# Altium project BUF802_Project.PrjPcb
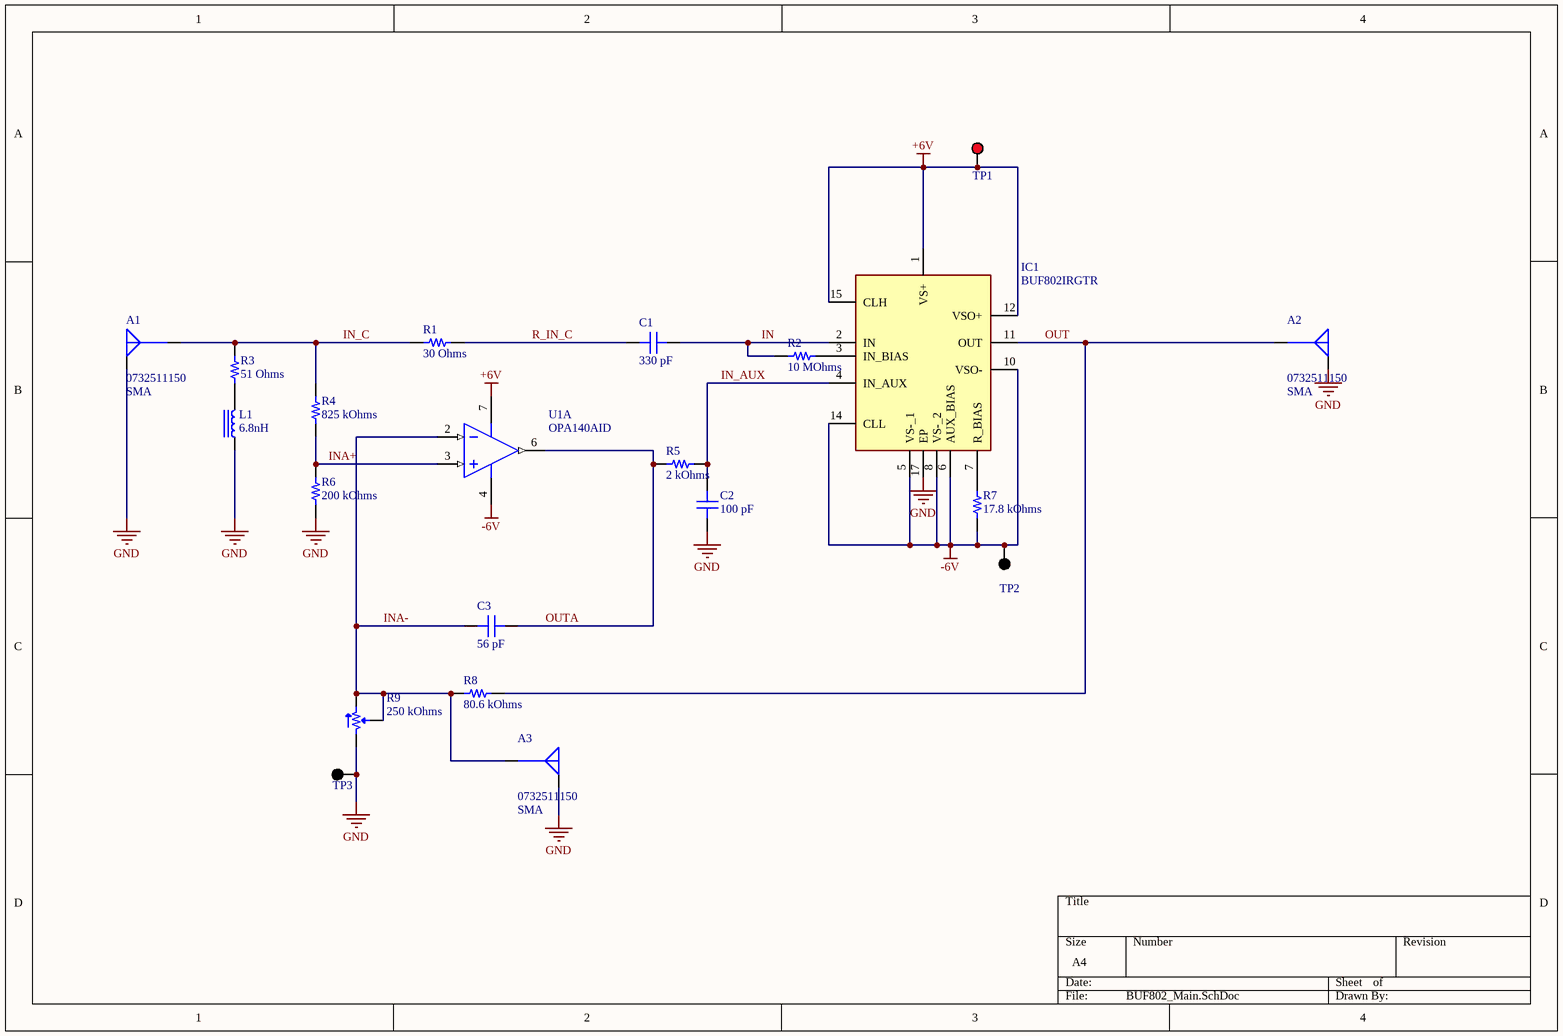
[diagram p0: BUF802_Main.SchDoc]
1 sheet, 21 parts. Net scope: global (net labels, ports and power ports of the same name join across sheets).
Board file: PCB.PcbDoc

## Sheet BUF802_Main.SchDoc
size A4; SheetNumber: 1; SheetTotal: 1

### Parts
A1  0732511150  Connector Style: SMA  [MOLEX SD-73251-115]
A2  0732511150  Connector Style: SMA  [MOLEX SD-73251-115]
A3  0732511150  Connector Style: SMA  [MOLEX SD-73251-115]
C1  330 pF  [CAP 0805_2012]
C2  100 pF  [CAP 0805_2012]
C3  56 pF  [CAP 0805_2012]
IC1  BUF802IRGTR  [QFN50P300X300X100-17N-D]
L1  6.8nH  [IND 0603_1608 RF WW]
R1  30 Ohms  [RES 0805_2012]
R2  10 MOhms  [RES 0805_2012]
R3  51 Ohms  [RES 0805_2012]
R4  825 kOhms  [RES 0805_2012]
R5  2 kOhms  [RES 0805_2012]
R6  200 kOhms  [RES 0805_2012]
R7  17.8 kOhms  [RES 0805_2012]
R8  80.6 kOhms  [RES 0805_2012]
R9  250 kOhms  [BOURNS TRIMPOT 3296W]
TP1  5000  [Keystone5000]  (value not drawn)
TP2  5001  [Keystone5001]  (value not drawn)
TP3  5001  [Keystone5001]  (value not drawn)
U1  OPA140AID  [D0008A_M]  (part A of 2)

### Nets
+6V: IC1.1(VS+) IC1.12(VSO+) IC1.15(CLH) TP1.1 U1.7(V+)
-6V: IC1.5(VS-_1) IC1.6(AUX_BIAS) IC1.8(VS-_2) IC1.10(VSO-) IC1.14(CLL) R7.1 TP2.1 U1.4(V-)
GND: A1.G A2.G A3.G C2.1 IC1.17(EP) L1.1 R6.1 R9.1 TP3.1
IN: C1.2 IC1.2(IN) R2.1
IN_AUX: C2.2 IC1.4(IN_AUX) R5.2
IN_C: A1.S R1.1 R3.2 R4.2
INA+: R4.1 R6.2 U1.3(IN+)
INA-: A3.S C3.1 R8.1 R9.2 R9.3 U1.2(IN-)
OUT: A2.S IC1.11(OUT) R8.2
OUTA: C3.2 R5.1 U1.6(OUT)
R_IN_C: C1.1 R1.2
NetIC1_3: IC1.3(IN_BIAS) R2.2
NetIC1_7: IC1.7(R_BIAS) R7.2
NetL1_2: L1.2 R3.1

### Library data of the parts
A1-A3 = 0732511150: CONN SMA RCPT STR 50OHM EDGE MNT; Manufacturer: Molex; Connector Type: Receptacle, Female Socket; Contact Termination: Solder; Frequency - Max: 18 GHz; Number of Ports: 1; Part Number: 0732511150; ComponentLink1Description: Datasheet; ComponentLink1URL: https://www.molex.com/pdm_docs/ps/PS-89675-346.pdf; ComponentLink2Description: DigiKey Link; ComponentLink2URL: https://www.digikey.com/en/products/detail/molex/0732511150/1465156; Fastening Type: Threaded; Housing Color: Gold; Impedance: 50Ohm; LastUpdated: 29-6-2022 18:06:18; Lifecycle Status: Active; Minimum Order: 1; Mounting Type: Board Edge, End Launch; Packaging: Tray; Part Status: Active; Price: 2.16; Series: 73251; Shield Termination: Solder; Supplier 1: DigiKey; Supplier Part Number 1: WM5534-ND
C1 = 0805N331K501NT: CAP CER 330PF 500V C0G/NP0 0805; manufacturer: Knowles Novacap; Temperature Coefficient: C0G, NP0; Tolerance: ±10%; Part Number: 0805N331K501NT; Value: 330 pF; Applications: General Purpose; Capacitance: 330 pF; componentlink1description: Datasheet; componentlink1url: https://www.knowlescapacitors.com/getattachment/f044c413-e6db-482e-8245-bb630384b177/Hi-Rel-C0G.aspx; componentlink2description: DigiKey Link; componentlink2url: https://www.digikey.com/en/products/detail/knowles-novacap/0805N331K501NT/7246439; Device Package: 0805 (2012 Metric); lastupdated: 28-4-2023 19:11:32; Lifecycle Status: Active; Minimum Order: 1; Mounting Type: Surface Mount, MLCC; Operating Temperature: -55°C ~ 125°C; Package / Case: 0805 (2012 Metric); packaging: TapeAndReel; partid: 14472; Part Status: Active; price: 0.09; series: -; Size / Dimension: 0.080" L x 0.050" W (2.03mm x 1.27mm); Supplier 1: DigiKey; Supplier Part Number 1: 1763-1199-1-ND; Thickness (Max): 0.054" (1.37mm); Voltage - Rated: 500V
C2 = 501R15N101KV4T: CAP CER 100PF 500V C0G/NP0 0805; manufacturer: Johanson Dielectrics Inc.; Temperature Coefficient: C0G, NP0; Tolerance: ±10%; Part Number: 501R15N101KV4T; Value: 100 pF; Applications: General Purpose; Capacitance: 100 pF; componentlink1description: Datasheet; componentlink1url: //media.digikey.com/pdf/Data%20Sheets/Johanson%20Dielectrics/High_Voltage_MLCC.pdf; componentlink2description: DigiKey Link; componentlink2url: https://www.digikey.com/en/products/detail/johanson-dielectrics-inc/501R15N101KV4T/1556341; Device Package: 0805 (2012 Metric); Features: High Voltage; lastupdated: 28-4-2023 19:11:22; Lifecycle Status: Active; Minimum Order: 1; Mounting Type: Surface Mount, MLCC; Operating Temperature: -55°C ~ 125°C; Package / Case: 0805 (2012 Metric); packaging: TapeAndReel; partid: 17109; Part Status: Active; price: 0.03; series: -; Size / Dimension: 0.080" L x 0.050" W (2.03mm x 1.27mm); Supplier 1: DigiKey; Supplier Part Number 1: 709-1019-1-ND; Thickness (Max): 0.055" (1.40mm); Voltage - Rated: 500V
C3 = 251R15S560GV4E: CAP CER 56PF 250V NP0 0805; manufacturer: Johanson Technology Inc.; Temperature Coefficient: C0G, NP0; Tolerance: ±2%; Part Number: 251R15S560GV4E; Value: 56 pF; Applications: RF, Microwave, High Frequency; Capacitance: 56 pF; componentlink1description: Datasheet; componentlink1url: https://www.johansontechnology.com/downloads/catalog/johanson-technology-multi-layer-high-q-capacitors.pdf; componentlink2description: DigiKey Link; componentlink2url: https://www.digikey.com/en/products/detail/johanson-technology-inc/251R15S560GV4E/1919542; Device Package: 0805 (2012 Metric); Features: High Q, Low Loss, Ultra Low ESR; lastupdated: 28-4-2023 19:11:18; Lifecycle Status: Active; Minimum Order: 1; Mounting Type: Surface Mount, MLCC; Operating Temperature: -55°C ~ 125°C; Package / Case: 0805 (2012 Metric); packaging: TapeAndReel; partid: 18415; Part Status: Active; price: 0.15; series: S; Size / Dimension: 0.080" L x 0.050" W (2.03mm x 1.27mm); Supplier 1: DigiKey; Supplier Part Number 1: 712-1747-1-ND; Thickness (Max): 0.046" (1.17mm); Voltage - Rated: 250V
IC1 = BUF802IRGTR: Integrated Circuit; Manufacturer_Name: Texas Instruments; Datasheet Link: https://www.ti.com/lit/ds/symlink/buf802.pdf?ts=1646208046294&ref_url=https%253A%252F%252Fwww.ti.com%252Fstore%252Fti%252Fen%252Fp%252Fproduct%252F%253Fp%253DBUF802IRGTR%2526keyMatch%253DBUF802IRGTR; Height: 1mm; Manufacturer_Part_Number: BUF802IRGTR; Mouser Part Number: 595-BUF802IRGTR; Mouser Price/Stock: https://www.mouser.co.uk/ProductDetail/Texas-Instruments/BUF802IRGTR?qs=doiCPypUmgEiF30IF7I3XQ%3D%3D
L1 = 744917068: FIXED IND 6.8NH 1.4A 42 MOHM SMD; Manufacturer: Würth Elektronik; DC Resistance (DCR): 42mOhm Max; Frequency - Self Resonant: 5.8GHz; Inductance Frequency - Test: 250MHz; Material - Core: Ceramic; Q @ Freq: 34 @ 250MHz; Shielding: Unshielded; Tolerance: ±2%; Type: Wirewound; Part Number: 744917068; ComponentLink1Description: Datasheet; ComponentLink1URL: https://katalog.we-online.de/pbs/datasheet/744917068.pdf; ComponentLink2Description: DigiKey Link; ComponentLink2URL: http://digikey.com/product-detail/en/w-rth-elektronik/744917068/732-11263-1-ND/6833722; Current Rating (Amps): 1.4A; Device Package: 0603 (1608 Metric); Height - Seated (Max): 0.044" (1.11mm); Inductance: 6.8nH; LastUpdated: 6-9-2020 11:05:16; Lifecycle Status: Active; Minimum Order: 0; Mounting Type: Surface Mount; Operating Temperature: -40°C ~ 125°C; Package / Case: 0603 (1608 Metric); Packaging: TapeAndReel; PartId: 808; Part Status: Active; Price: 0.46; Series: WE-KI HC; Size / Dimension: 0.067" L x 0.043" W (1.70mm x 1.10mm); Supplier 1: DigiKey; Supplier Part Number 1: 732-11263-1-ND; Supplier Device Package: 0603 (1608 Metric); Value: 6.8nH
R1 = AC0805FR-0730RL: RES SMD 30 OHM 1% 1/8W 0805; Manufacturer: Yageo; Power (Watts): 0.125W, 1/8W; Temperature Coefficient: ±100ppm/°C; Part Number: AC0805FR-0730RL; Value: 30 Ohms; ComponentLink1Description: Datasheet; ComponentLink1URL: https://www.yageo.com/upload/media/product/productsearch/datasheet/rchip/PYu-AC_51_RoHS_L_7.pdf; ComponentLink2Description: DigiKey Link; ComponentLink2URL: https://www.digikey.com/en/products/detail/yageo/AC0805FR-0730RL/5896763; Composition: Thick Film; Device Package: 0805 (2012 Metric); Features: Automotive AEC-Q200, Moisture Resistant; Height - Seated (Max): 0.024" (0.60mm); LastUpdated: 29-4-2023 19:50:29; Lifecycle Status: Active; Minimum Order: 1; Number of Terminations: 2; Operating Temperature: -55°C ~ 155°C; Package / Case: 0805 (2012 Metric); Packaging: TapeAndReel; PartId: 49539; Part Status: Active; Price: 0.01; Ratings: AEC-Q200; Resistance: 30 Ohms; Series: AC; Size / Dimension: 0.079" L x 0.049" W (2.00mm x 1.25mm); Supplier 1: DigiKey; Supplier Part Number 1: YAG3722CT-ND; Supplier Device Package: 0805; Tolerance: ±1%
R2 = ERJ-6GEYJ106V: RES SMD 10M OHM 5% 1/8W 0805; Manufacturer: Panasonic Electronic Components; Power (Watts): 0.125W, 1/8W; Temperature Coefficient: -400/ +150ppm/°C; Part Number: ERJ-6GEYJ106V; Value: 10 MOhms; ComponentLink1Description: Datasheet; ComponentLink1URL: http://industrial.panasonic.com/www-cgi/jvcr13pz.cgi?E+PZ+3+AOA0001+ERJ6GEYJ106V+7+WW; ComponentLink2Description: DigiKey Link; ComponentLink2URL: https://www.digikey.com/en/products/detail/panasonic-electronic-components/ERJ-6GEYJ106V/282189; Composition: Thick Film; Device Package: 0805 (2012 Metric); Features: Automotive AEC-Q200; Height - Seated (Max): 0.028" (0.70mm); LastUpdated: 28-4-2023 19:41:19; Lifecycle Status: Active; Minimum Order: 1; Number of Terminations: 2; Operating Temperature: -55°C ~ 155°C; Package / Case: 0805 (2012 Metric); Packaging: TapeAndReel; PartId: 47715; Part Status: Active; Price: 0.01; Ratings: AEC-Q200; Resistance: 10 MOhms; Series: ERJ-6G; Size / Dimension: 0.079" L x 0.049" W (2.00mm x 1.25mm); Supplier 1: DigiKey; Supplier Part Number 1: P10MACT-ND; Supplier Device Package: 0805; Tolerance: ±5%
R3 = CR0805-FX-51R0ELF: RES SMD 51 OHM 1% 1/8W 0805; Manufacturer: Bourns Inc.; Power (Watts): 0.125W, 1/8W; Temperature Coefficient: ±100ppm/°C; Part Number: CR0805-FX-51R0ELF; Value: 51 Ohms; ComponentLink1Description: Datasheet; ComponentLink1URL: https://www.bourns.com/docs/Product-Datasheets/CHPREZTR.pdf; ComponentLink2Description: DigiKey Link; ComponentLink2URL: https://www.digikey.com/en/products/detail/bourns-inc/CR0805-FX-51R0ELF/3785003; Composition: Thick Film; Device Package: 0805 (2012 Metric); Features: Moisture Resistant; Height - Seated (Max): 0.024" (0.60mm); LastUpdated: 29-4-2023 19:51:57; Lifecycle Status: Active; Minimum Order: 1; Number of Terminations: 2; Operating Temperature: -55°C ~ 155°C; Package / Case: 0805 (2012 Metric); Packaging: CutTape; PartId: 32487; Part Status: Active; Price: 0.01; Resistance: 51 Ohms; Series: CR0805; Size / Dimension: 0.079" L x 0.049" W (2.00mm x 1.25mm); Supplier 1: DigiKey; Supplier Part Number 1: 118-CR0805-FX-51R0ELFCT-ND; Supplier Device Package: 0805; Tolerance: ±1%
R4 = ERA-6AEB8253V: RES 825K OHM 0.1% 1/8W 0805; Manufacturer: Panasonic Electronic Components; Power (Watts): 0.125W, 1/8W; Temperature Coefficient: ±25ppm/°C; Part Number: ERA-6AEB8253V; Value: 825 kOhms; ComponentLink1Description: Datasheet; ComponentLink1URL: https://industrial.panasonic.com/cdbs/www-data/pdf/RDM0000/AOA0000C307.pdf; ComponentLink2Description: DigiKey Link; ComponentLink2URL: https://www.digikey.com/en/products/detail/panasonic-electronic-components/ERA-6AEB8253V/2025926; Composition: Thin Film; Device Package: 0805 (2012 Metric); Features: Automotive AEC-Q200; Height - Seated (Max): 0.024" (0.60mm); LastUpdated: 28-4-2023 19:41:42; Lifecycle Status: Active; Minimum Order: 1; Number of Terminations: 2; Operating Temperature: -55°C ~ 155°C; Package / Case: 0805 (2012 Metric); Packaging: TapeAndReel; PartId: 43407; Part Status: Active; Price: 0.03; Ratings: AEC-Q200; Resistance: 825 kOhms; Series: ERA-6A; Size / Dimension: 0.079" L x 0.049" W (2.00mm x 1.25mm); Supplier 1: DigiKey; Supplier Part Number 1: P825KDACT-ND; Supplier Device Package: 0805; Tolerance: ±0.1%
R5 = ERA-6AEB202V: RES 2K OHM 0.1% 1/8W 0805; Manufacturer: Panasonic Electronic Components; Power (Watts): 0.125W, 1/8W; Temperature Coefficient: ±25ppm/°C; Part Number: ERA-6AEB202V; Value: 2 kOhms; ComponentLink1Description: Datasheet; ComponentLink1URL: https://industrial.panasonic.com/cdbs/www-data/pdf/RDM0000/AOA0000C307.pdf; ComponentLink2Description: DigiKey Link; ComponentLink2URL: https://www.digikey.com/en/products/detail/panasonic-electronic-components/ERA-6AEB202V/1465756; Composition: Thin Film; Device Package: 0805 (2012 Metric); Features: Automotive AEC-Q200; Height - Seated (Max): 0.024" (0.60mm); LastUpdated: 28-4-2023 19:42:36; Lifecycle Status: Active; Minimum Order: 1; Number of Terminations: 2; Operating Temperature: -55°C ~ 155°C; Package / Case: 0805 (2012 Metric); Packaging: TapeAndReel; PartId: 28084; Part Status: Active; Price: 0.03; Ratings: AEC-Q200; Resistance: 2 kOhms; Series: ERA-6A; Size / Dimension: 0.079" L x 0.049" W (2.00mm x 1.25mm); Supplier 1: DigiKey; Supplier Part Number 1: P2.0KDACT-ND; Supplier Device Package: 0805; Tolerance: ±0.1%
R6 = ERA-6AEB204V: RES 200K OHM 0.1% 1/8W 0805; Manufacturer: Panasonic Electronic Components; Power (Watts): 0.125W, 1/8W; Temperature Coefficient: ±25ppm/°C; Part Number: ERA-6AEB204V; Value: 200 kOhms; ComponentLink1Description: Datasheet; ComponentLink1URL: https://industrial.panasonic.com/cdbs/www-data/pdf/RDM0000/AOA0000C307.pdf; ComponentLink2Description: DigiKey Link; ComponentLink2URL: https://www.digikey.com/en/products/detail/panasonic-electronic-components/ERA-6AEB204V/1465804; Composition: Thin Film; Device Package: 0805 (2012 Metric); Features: Automotive AEC-Q200; Height - Seated (Max): 0.024" (0.60mm); LastUpdated: 28-4-2023 19:42:36; Lifecycle Status: Active; Minimum Order: 1; Number of Terminations: 2; Operating Temperature: -55°C ~ 155°C; Package / Case: 0805 (2012 Metric); Packaging: TapeAndReel; PartId: 28091; Part Status: Active; Price: 0.03; Ratings: AEC-Q200; Resistance: 200 kOhms; Series: ERA-6A; Size / Dimension: 0.079" L x 0.049" W (2.00mm x 1.25mm); Supplier 1: DigiKey; Supplier Part Number 1: P200KDACT-ND; Supplier Device Package: 0805; Tolerance: ±0.1%
R7 = ERJ-PB6B1782V: RES SMD 17.8K OHM 0.1% 1/4W 0805; Manufacturer: Panasonic Electronic Components; Power (Watts): 0.25W, 1/4W; Temperature Coefficient: ±50ppm/°C; Part Number: ERJ-PB6B1782V; Value: 17.8 kOhms; ComponentLink1Description: Datasheet; ComponentLink1URL: https://industrial.panasonic.com/cdbs/www-data/pdf/RDM0000/AOA0000C328.pdf; ComponentLink2Description: DigiKey Link; ComponentLink2URL: https://www.digikey.com/en/products/detail/panasonic-electronic-components/ERJ-PB6B1782V/6213517; Composition: Thick Film; Device Package: 0805 (2012 Metric); Features: Automotive AEC-Q200, Pulse Withstanding; Height - Seated (Max): 0.028" (0.70mm); LastUpdated: 28-4-2023 19:41:43; Lifecycle Status: Active; Minimum Order: 1; Number of Terminations: 2; Operating Temperature: -55°C ~ 155°C; Package / Case: 0805 (2012 Metric); Packaging: TapeAndReel; PartId: 43282; Part Status: Active; Price: 0.04; Ratings: AEC-Q200; Resistance: 17.8 kOhms; Series: ERJ-PB6; Size / Dimension: 0.079" L x 0.049" W (2.00mm x 1.25mm); Supplier 1: DigiKey; Supplier Part Number 1: P20734CT-ND; Supplier Device Package: 0805; Tolerance: ±0.1%
R8 = ERA-6AEB8062V: RES 80.6K OHM 0.1% 1/8W 0805; Manufacturer: Panasonic Electronic Components; Power (Watts): 0.125W, 1/8W; Temperature Coefficient: ±25ppm/°C; Part Number: ERA-6AEB8062V; Value: 80.6 kOhms; ComponentLink1Description: Datasheet; ComponentLink1URL: https://industrial.panasonic.com/cdbs/www-data/pdf/RDM0000/AOA0000C307.pdf; ComponentLink2Description: DigiKey Link; ComponentLink2URL: https://www.digikey.com/en/products/detail/panasonic-electronic-components/ERA-6AEB8062V/2025835; Composition: Thin Film; Device Package: 0805 (2012 Metric); Features: Automotive AEC-Q200; Height - Seated (Max): 0.024" (0.60mm); LastUpdated: 28-4-2023 19:42:36; Lifecycle Status: Active; Minimum Order: 1; Number of Terminations: 2; Operating Temperature: -55°C ~ 155°C; Package / Case: 0805 (2012 Metric); Packaging: TapeAndReel; PartId: 28140; Part Status: Active; Price: 0.04; Ratings: AEC-Q200; Resistance: 80.6 kOhms; Series: ERA-6A; Size / Dimension: 0.079" L x 0.049" W (2.00mm x 1.25mm); Supplier 1: DigiKey; Supplier Part Number 1: P80.6KDACT-ND; Supplier Device Package: 0805; Tolerance: ±0.1%
R9 = 3296W-1-254LF: TRIMMER 250K OHM 0.5W PC PIN TOP; Manufacturer: Bourns Inc.; Adjustment Type: Top Adjustment; Number of Turns: 25; Power (Watts): 0.5W, 1/2W; Resistive Material: Cermet; Temperature Coefficient: ±100ppm/°C; Tolerance: ±10%; Part Number: 3296W-1-254LF; ComponentLink1Description: Datasheet; ComponentLink1URL: https://www.bourns.com/docs/Product-Datasheets/3296.pdf; ComponentLink2Description: DigiKey Link; ComponentLink2URL: https://www.digikey.com/en/products/detail/bourns-inc/3296W-1-254LF/1088055; LastUpdated: 16-3-2023 20:10:45; Lifecycle Status: Active; Minimum Order: 1; Mounting Type: Through Hole; Packaging: Tube; PartId: 238; Part Status: Active; Price: 1.35; Resistance: 250 kOhms; Series: Trimpot® 3296 - Sealed; Size / Dimension: Rectangular - 0.375" x 0.190" Face (9.53mm x 4.83mm); Supplier 1: DigiKey; Supplier Part Number 1: 3296W-254LF-ND; Termination Style: PC Pins; Value: 250 kOhms
TP1 = 5000: Test Point, Miniature, Red, TH; Manufacturer: Keystone; CompType: Test Point Loop; ContactFinish: Silver; SymbolVersion: 2008-04-04; PartNumber: 5000; PackageReference: Red Miniature Testpoint; RoHS: Y; MountType: TH; ComponentLink1Description: Datasheet URL; ComponentLink1URL: http://www.keyelco.com/userAssets/file/M60-2p60.pdf; Color: Red; Publisher: Texas Instruments; LatestRevisionDate: 2017-01-19; Supplier 1: Digi-Key; Supplier Part Number 1: 36-5000-ND; Supplier 2: Mouser; Supplier Part Number 2: 534-5000
TP2 TP3 = 5001: Test Point, Miniature, Black, TH; Manufacturer: Keystone; CompType: Test Point Loop; ContactFinish: Silver; Green_Lifecycle: Active; Green_REACh: Passed; SymbolVersion: 2008-04-04; PartNumber: 5001; PackageReference: Black Miniature Testpoint; RoHS: Y; MountType: TH; ComponentLink1Description: Datasheet URL; ComponentLink1URL: http://www.keyelco.com/userAssets/file/M60-2p60.pdf; Color: Black; Publisher: Texas Instruments; LatestRevisionDate: 2017-05-11; Supplier 1: Digi-Key; Supplier Part Number 1: 36-5001-ND; Supplier 2: Mouser; Supplier Part Number 2: 534-5001; Green_EU RoHS: Passed; Green_EU RoHS-2: Incomplete
U1 = CMP-0271-00131-3: 11 MHz, Single Supply, Low Noise, Precision, Rail-to-Rail Output, JFET Amplifier, 4.5 to 36 V, -40 to 125 degC, 8-pin SOIC (D8), Green (RoHS & no Sb/Br); Manufacturer: Texas Instruments; Vio (25C)(Max)(mV): 0.12; Number of Channels: 1; Packing: TUBE; Rating: Catalog; Offset Drift(Typ)(uV/C): 0.35; Sub Family: High Supply Voltage Amplifier (>=30V), Low Input Bias Current Amp (<=10pA), Low Noise Amp (<=10nV/rtHz), Low Offset Voltage Amplifier (<=500uV), Precision Amplifier; Total Supply Voltage(Min)(+5V is 5, +/-5V is 10): 4.5; Iq per channel(Max)(mA): 2; Total Supply Voltage(Max)(+5V is 5, +/-5V is 10): 36; IIB(Max)(pA): 10; GBW(Typ)(MHz): 11; CMRR(Min)(dB): 126; Slew Rate(Typ)(V/us): 20; PackageDescription: 8-Pin Plastic Small Outline, Body 4.9 x 3.9 mm, Pitch 1.27 mm; PackageReference: D0008A; ComponentLink3Description: Package Specification; ComponentLink3URL: http://www.ti.com/litv/pdf/msoi002j; DatasheetVersion: SBOS498A; Mounting Technology: Surface Mount; ComponentLink2Description: Datasheet; ComponentLink2URL: http://www.ti.com/lit/ds/symlink/opa140.pdf; ComponentLink1Description: Manufacturer URL; ComponentLink1URL: http://www.ti.com/; PackageVersion: 4040047-3/M, 06/2011; Code_JEDEC: MS-012; Eco-Plan: Green (RoHS & no Sb/Br); PartNumber: OPA140AID